# EAGLE design RGB_DMD_MINI (EAGLE 7.4.0)
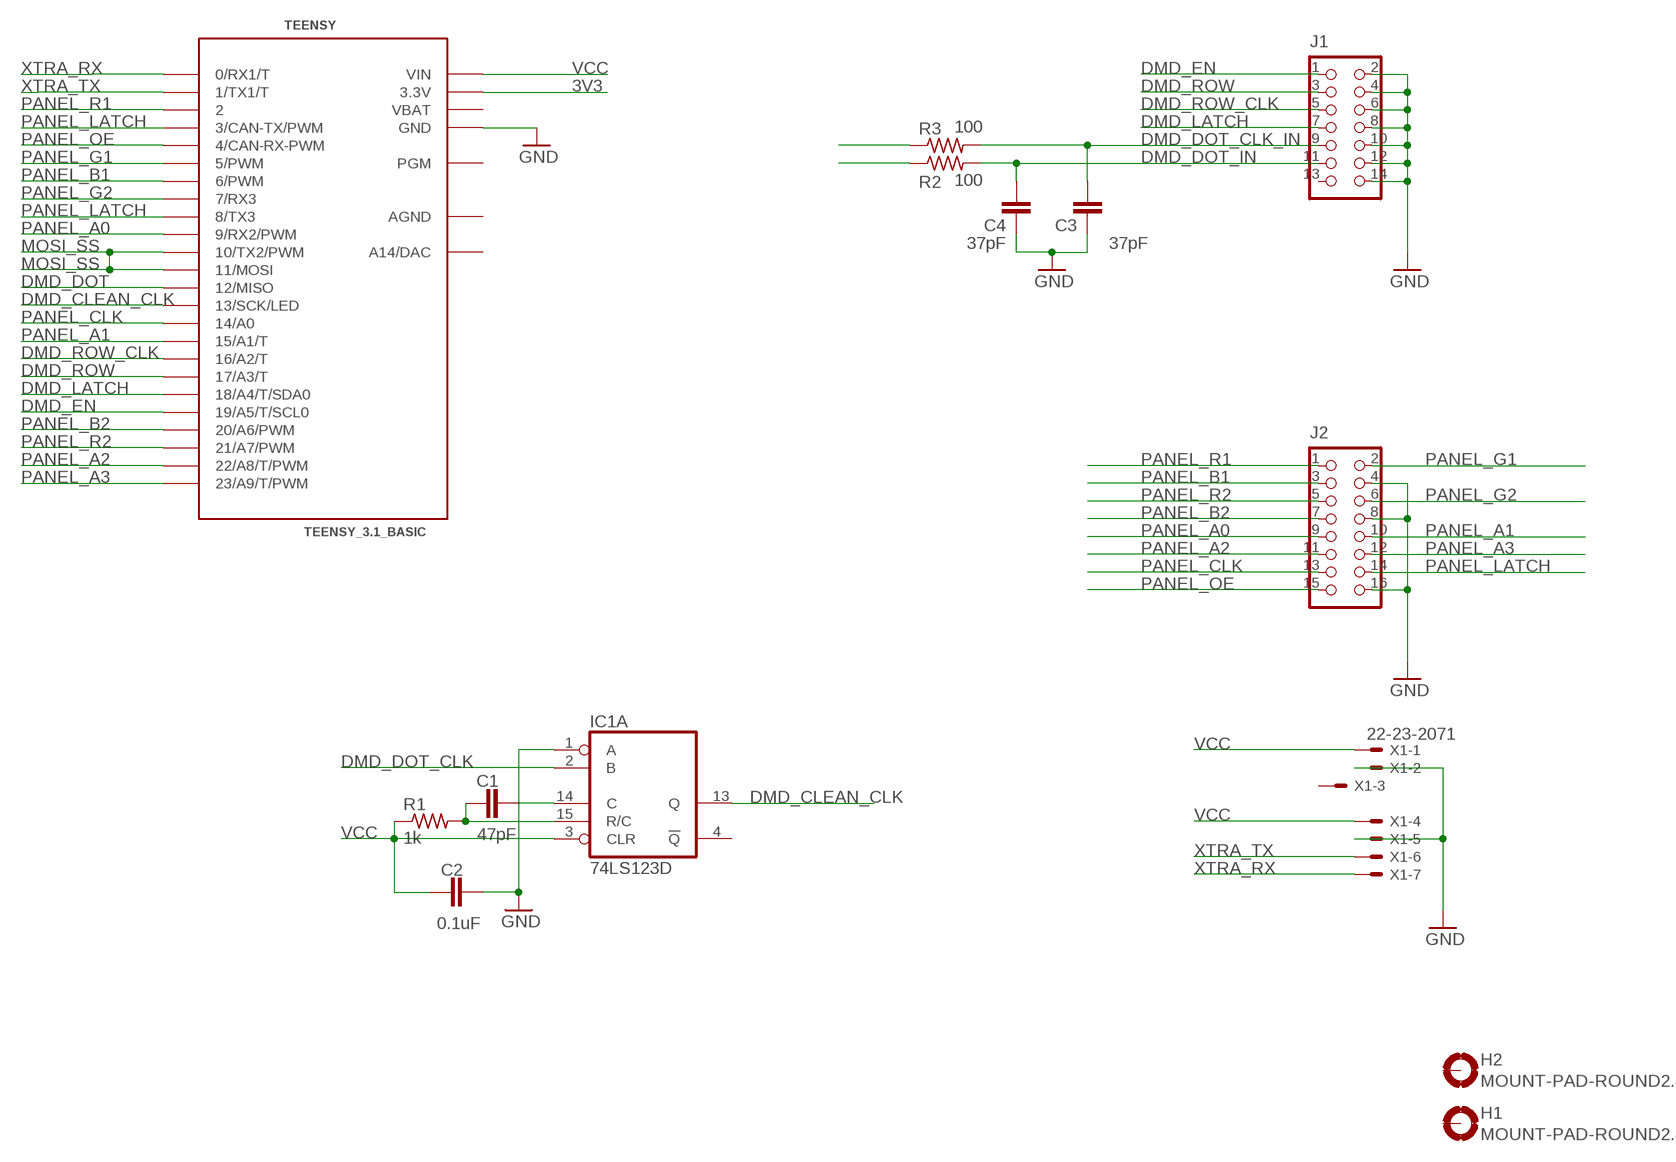
[diagram p0: schematic, sheet 1]

## Parts
C1  47pF  C-EUC0603  [C0603]
C2  0.1uF  C-EUC0603  [C0603]
C3  37pF  C-EUC0603  [C0603]
C4  37pF  C-EUC0603  [C0603]
H1  MOUNT-PAD-ROUND2.8  [2,8-PAD]
H2  MOUNT-PAD-ROUND2.8  [2,8-PAD]
IC1  74LS123D  [SO16]
J1  CON_HEADER_2X07-PTH-SHROUDED  [PINSHRD_PTH_2X07]
J2  CON_HEADER_2X08-PTH-SHROUDED  [PINSHRD_PTH_2X08]
R1  1k  R-US_R0603  [R0603]
R2  100  R-US_R0603  [R0603]
R3  100  R-US_R0603  [R0603]
TEENSY  TEENSY_3.1_BASIC  [TEENSY_3.1_BASIC]
X1  22-23-2071  [22-23-2071]

## Nets
3V3: TEENSY.3.3V TEENSY.3.3V1(3.3V)
DMD_CLEAN_CLK: IC1.13(A:Q) TEENSY.13(13/SCK/LED)
DMD_DOT: R2.1 TEENSY.12(12/MISO)
DMD_DOT_CLK: IC1.2(A:B) R3.1
DMD_DOT_CLK_IN: C3.2 J1.9 R3.2
DMD_DOT_IN: C4.2 J1.11 R2.2
DMD_EN: J1.1 TEENSY.19/A5(19/A5/T/SCL0)
DMD_LATCH: J1.7 TEENSY.18/A4(18/A4/T/SDA0)
DMD_ROW: J1.3 TEENSY.17/A3(17/A3/T)
DMD_ROW_CLK: J1.5 TEENSY.16/A2(16/A2/T)
GND: C2.2 C3.1 C4.1 IC1.1(A:A) J1.2 J1.4 J1.6 J1.8 J1.10 J1.12 J1.14 J2.4 J2.8 J2.16 TEENSY.GND TEENSY.GND1(GND) X1.2 X1.5
MOSI_SS: TEENSY.10(10/TX2/PWM) TEENSY.11(11/MOSI)
N$1: C1.1 IC1.15(A:R/C) R1.2
N$2: C1.2 IC1.14(A:C)
PANEL_A0: J2.9 TEENSY.9(9/RX2/PWM)
PANEL_A1: J2.10 TEENSY.15/A1(15/A1/T)
PANEL_A2: J2.11 TEENSY.22/A8(22/A8/T/PWM)
PANEL_A3: J2.12 TEENSY.23/A9(23/A9/T/PWM)
PANEL_B1: J2.3 TEENSY.6(6/PWM)
PANEL_B2: J2.7 TEENSY.20/A6(20/A6/PWM)
PANEL_CLK: J2.13 TEENSY.14/A0
PANEL_G1: J2.2 TEENSY.5(5/PWM)
PANEL_G2: J2.6 TEENSY.7(7/RX3)
PANEL_LATCH: J2.14 TEENSY.3(3/CAN-TX/PWM) TEENSY.8(8/TX3)
PANEL_OE: J2.15 TEENSY.4(4/CAN-RX-PWM)
PANEL_R1: J2.1 TEENSY.2
PANEL_R2: J2.5 TEENSY.21/A7(21/A7/PWM)
VCC: C2.1 IC1.3(A:CLR) R1.1 TEENSY.VIN X1.1 X1.4
XTRA_RX: TEENSY.0(0/RX1/T) X1.7
XTRA_TX: TEENSY.1(1/TX1/T) X1.6
Unconnected: H1.B2,8(MOUNT) H2.B2,8(MOUNT) IC1.4(A:!Q) IC1.5(B:Q) IC1.6(B:C) IC1.7(B:R/C) IC1.9(B:A) IC1.10(B:B) IC1.11(B:CLR) IC1.12(B:!Q) J1.13 TEENSY.A14(A14/DAC) TEENSY.PGM X1.3

## Power pins joined to a net without a drawn wire
AGND: TEENSY.AGND
GND: IC1.8(P:GND)
VBAT: TEENSY.VBAT
VCC: IC1.16(P:VCC)

## Library data of the parts
C1-C4 = resistor:C-EU: CAPACITOR, European symbol
H1 H2 = holes:MOUNT-PAD-ROUND: MOUNTING PAD, round
IC1 = 74xx-us:74*123: Retriggerable monostable MULTIVIBRATOR
J1 = dp_devices:CON_HEADER_2X07: 2x07 pin header
J2 = SmartMatrixShield_V1:CON_HEADER_2X08: 2x07 pin header
R1-R3 = resistor:R-US_: RESISTOR, American symbol
TEENSY = Teensy_3_Series_Board_v1.0:TEENSY_3.1_BASIC: Footprint for Teensy 3.1 board using all pin connections on the outer perimeter
X1 = con-molex:22-23-2071: .100" (2.54mm) Center Header - 7 Pin; MF: MOLEX; MPN: 22-23-2071; OC_FARNELL: 1654534; OC_NEWARK: 56H0445

## Board
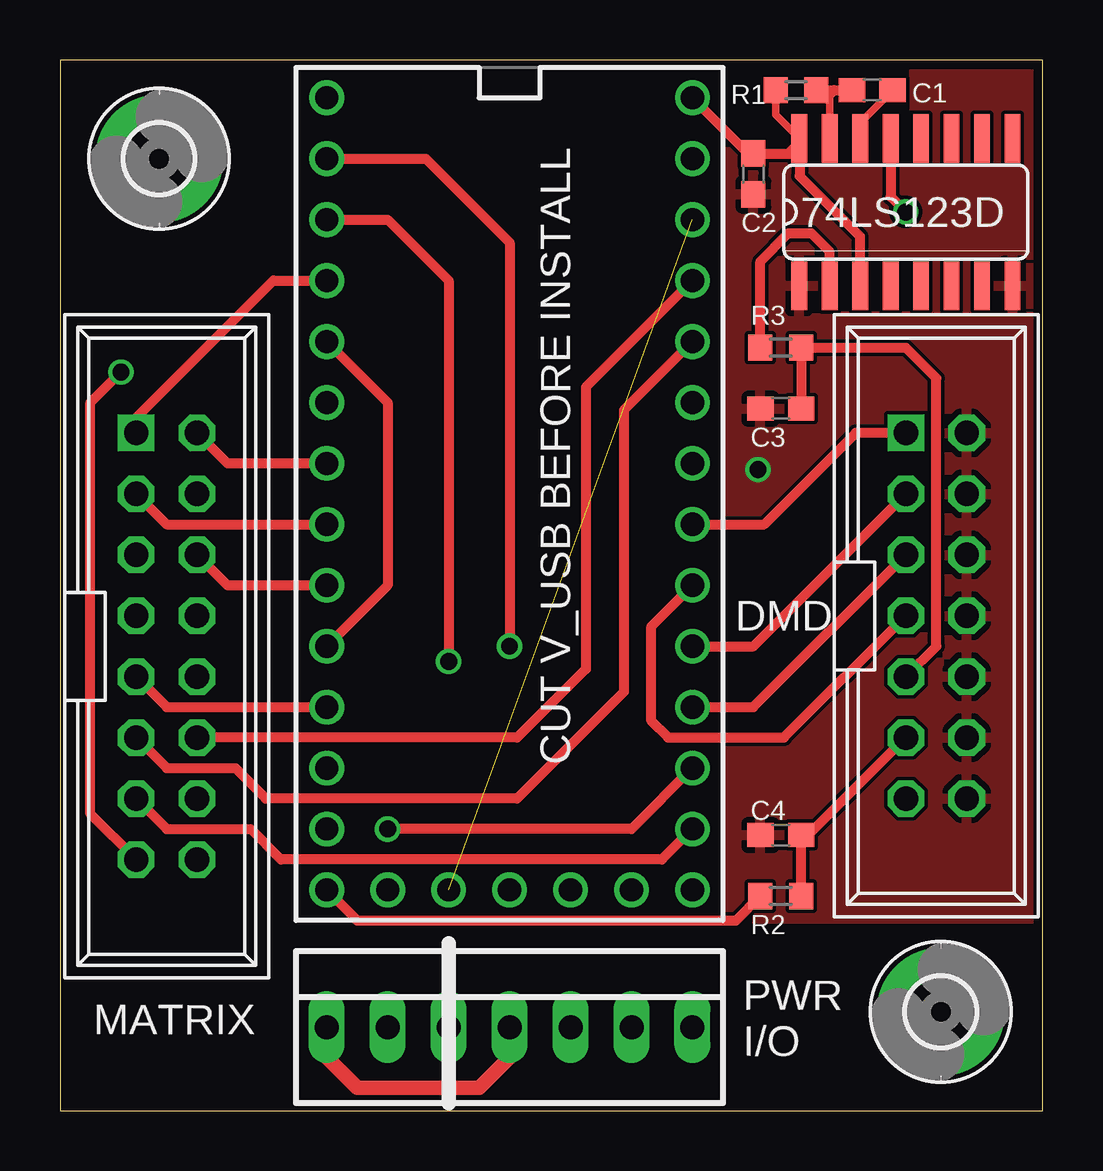
[diagram p1: board, top side]
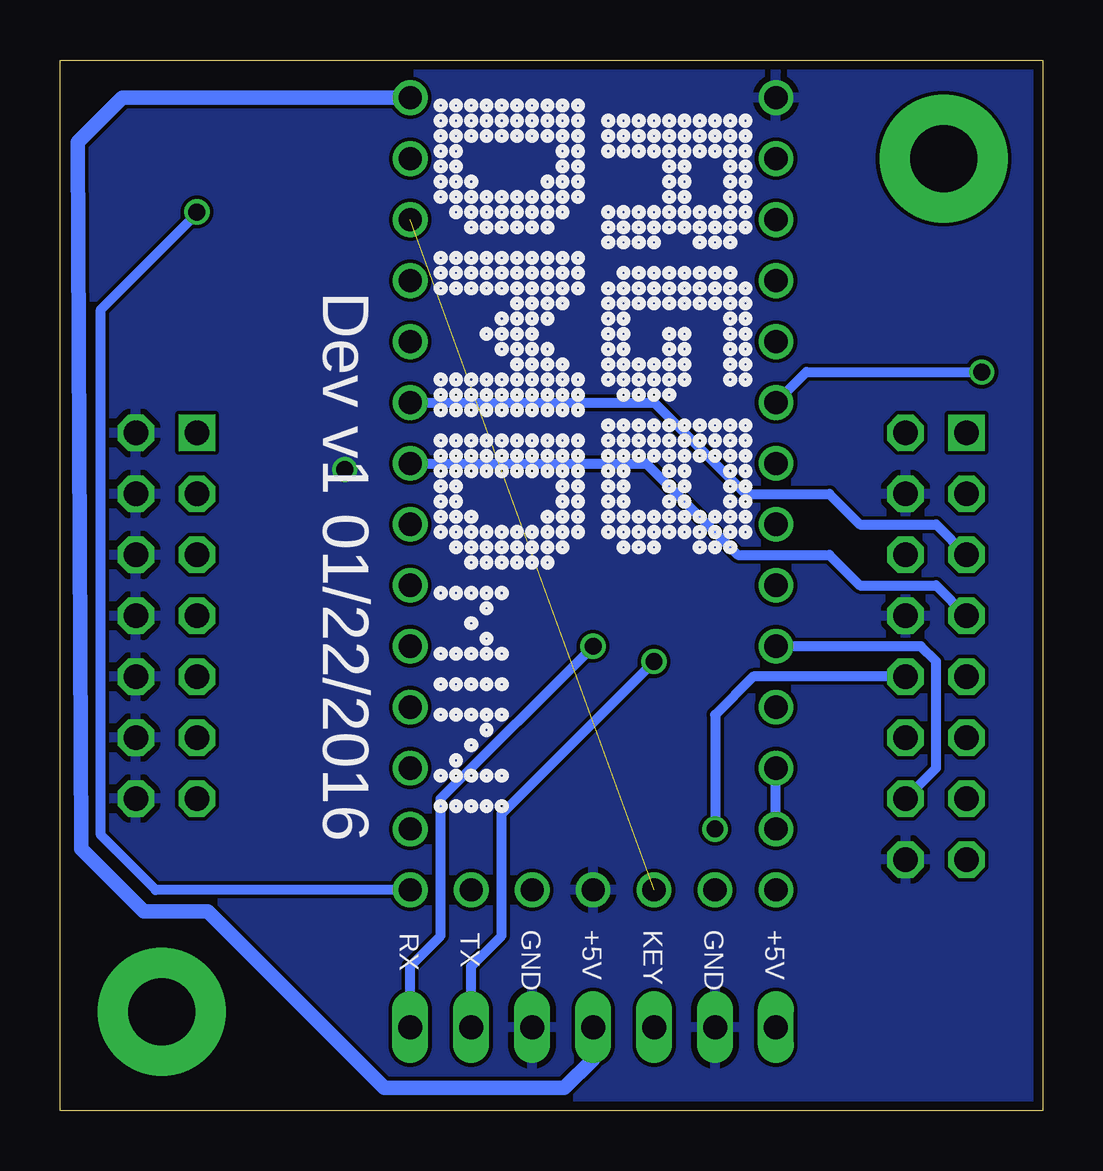
[diagram p2: board, bottom side, seen from below]

Size 40.95 x 43.8 mm. Coordinates in mm from the lower left corner, seen from the top.
Outline: 0,0 40.95,0 40.95,43.81 0,43.81 0,0
Copper layers (1*16): Top 0.0356mm / dielectric 1.5011mm / Bottom 0.0356mm
Design rules "LaenPCBOrder": minimum track width 6mil, minimum drill 13mil, track to track 6mil, track to pad 6mil, pad to pad 6mil, via to via 6mil, smd to smd 6mil, copper to edge 15mil, drill to drill 6mil, minimum pad ring 7mil, minimum via ring 7mil, stop-mask expansion 3mil, vias tented up to drill 0mil, thermal gap 10mil

### Footprints (pad centres in the part's own frame; a part is rotated, then mirrored left to right if it is on the bottom)
C0603 = smd 1.1 x 1: 1 -0.85,0; 2 0.85,0
2,8-PAD = drill 2.8 pad 5.334: B2,8 0,0
SO16 = smd 0.66 x 2.032: 1 -4.445,-3.073; 2 -3.175,-3.073; 3 -1.905,-3.073; 4 -0.635,-3.073; 5 0.635,-3.073; 6 1.905,-3.073; 7 3.175,-3.073; 8 4.445,-3.073; 9 4.445,3.073; 10 3.175,3.073; 11 1.905,3.073; 12 0.635,3.073; 13 -0.635,3.073; 14 -1.905,3.073; 15 -3.175,3.073; 16 -4.445,3.073
PINSHRD_PTH_2X07 = drill 1.016 square: 1 -7.62,-1.27 | drill 1.016 octagon: 2 -7.62,1.27; 3 -5.08,-1.27; 4 -5.08,1.27; 5 -2.54,-1.27; 6 -2.54,1.27; 7 0,-1.27; 8 0,1.27; 9 2.54,-1.27; 10 2.54,1.27; 11 5.08,-1.27; 12 5.08,1.27; 13 7.62,-1.27; 14 7.62,1.27
PINSHRD_PTH_2X08 = drill 1.016 square: 1 -8.89,-1.27 | drill 1.016 octagon: 2 -8.89,1.27; 3 -6.35,-1.27; 4 -6.35,1.27; 5 -3.81,-1.27; 6 -3.81,1.27; 7 -1.27,-1.27; 8 -1.27,1.27; 9 1.27,-1.27; 10 1.27,1.27; 11 3.81,-1.27; 12 3.81,1.27; 13 6.35,-1.27; 14 6.35,1.27; 15 8.89,-1.27; 16 8.89,1.27
R0603 = smd 1 x 1.1: 1 -0.85,0; 2 0.85,0
TEENSY_3.1_BASIC = drill 0.965: 0 -7.62,13.97; 1 -7.62,11.43; 2 -7.62,8.89; 3 -7.62,6.35; 3.3V 7.62,11.43; 3.3V1 -2.54,-16.51; 4 -7.62,3.81; 5 -7.62,1.27; 6 -7.62,-1.27; 7 -7.62,-3.81; 8 -7.62,-6.35; 9 -7.62,-8.89; 10 -7.62,-11.43; 11 -7.62,-13.97; 12 -7.62,-16.51; 13 7.62,-16.51; 14/A0 7.62,-13.97; 15/A1 7.62,-11.43; 16/A2 7.62,-8.89; 17/A3 7.62,-6.35; 18/A4 7.62,-3.81; 19/A5 7.62,-1.27; 20/A6 7.62,1.27; 21/A7 7.62,3.81; 22/A8 7.62,6.35; 23/A9 7.62,8.89; A14 5.08,-16.51; AGND 7.62,13.97; GND -7.62,16.51; GND1 0,-16.51; PGM 2.54,-16.51; VBAT -5.08,-16.51; VIN 7.62,16.51
22-23-2071 = drill 1 long: 1 -7.62,0; 2 -5.08,0; 3 -2.54,0; 4 0,0; 5 2.54,0; 6 5.08,0; 7 7.62,0

### Placement (x,y rotation side)
C1  33.85,42.54 0 top
C2  28.89,39.05 270 top
C3  30.04,29.27 0 top
C4  30.04,11.49 0 top
H1  4.13,39.69 0 top
H2  36.7,4.13 0 top
IC1  35.24,37.46 0 top
J1  36.51,20.64 270 top
J2  4.45,19.37 270 top
R1  30.67,42.54 0 top
R2  30.04,8.95 0 top
R3  30.04,31.81 0 top
TEENSY  18.73,25.72 0 top
X1  18.73,3.49 0 top

### Tracks (layer width: path | path; a pad name or v marks a point on that pad's centre or on a via)
3V3  (1 unrouted)
DMD_CLEAN_CLK  (via drill 0.7)
  Top 0.406: IC1.13 34.61,38.1 v35.24,37.46
  Bottom 0.406: TEENSY.13 36.96,9.21 39.24,11.49 39.24,33.4 35.24,37.4 v35.24,37.46
DMD_DOT
  Top 0.406: TEENSY.12 12.38,7.94 28.17,7.94 R2.1
DMD_DOT_CLK
  Top 0.406: R3.1 29.19,35.41 30.35,36.58 31.31,36.58 32.07,35.81 IC1.2
DMD_DOT_CLK_IN
  Top 0.406: C3.2 R3.2 35.24,31.81 36.51,30.54 36.51,19.37 J1.9
DMD_DOT_IN
  Top 0.406: R2.2 C4.2 31.18,11.49 J1.11
DMD_EN
  Top 0.406: TEENSY.19/A5 29.34,24.45 33.15,28.26 J1.1
DMD_LATCH
  Top 0.406: TEENSY.18/A4 24.64,20.19 24.64,16.26 25.34,15.56 30.16,15.56 J1.7
DMD_ROW
  Top 0.406: TEENSY.17/A3 28.89,19.37 J1.3
DMD_ROW_CLK
  Top 0.406: TEENSY.16/A2 28.89,16.83 J1.5
GND  (via drill 0.7)
  other vias: 29.08,26.73
  pour Bottom: 0.32,43.5 40.64,43.5 40.64,0.32 0.32,0.32
  pour Top: 27.81,43.24 40.51,43.24 40.51,8 27.81,8
MOSI_SS
  Bottom 0.406: TEENSY.11 TEENSY.10
N$1
  Top 0.305: IC1.15 32.07,42.35
  Top 0.406: R1.2 32.26,42.54 | 32.26,42.54 C1.1 | 32.07,42.35 32.26,42.54
N$2
  Top 0.305: 33.34,41.19 C1.2
  Top 0.406: IC1.14 33.34,41.19
PANEL_A0
  Top 0.406: J2.9 4.45,16.83 TEENSY.9
PANEL_A1  (via drill 0.7)
  Top 0.406: TEENSY.15/A1 23.81,11.75 v13.65,11.75
  Bottom 0.406: J2.10 12.06,18.1 13.65,16.51 v13.65,11.75
PANEL_A2
  Top 0.406: J2.11 4.45,14.29 7.3,14.29 8.57,13.02 19.05,13.02 23.5,17.46 23.5,29.21 TEENSY.22/A8
PANEL_A3
  Top 0.406: J2.12 19.05,15.56 21.91,18.42 21.91,30.16 TEENSY.23/A9
PANEL_B1
  Top 0.406: J2.3 4.45,24.45 TEENSY.6
PANEL_B2
  Bottom 0.406: TEENSY.20/A6 16.51,26.99 12.7,23.18 8.89,23.18 7.62,21.91 4.45,21.91 J2.7
PANEL_CLK
  Top 0.406: TEENSY.14/A0 25.08,10.48 9.21,10.48 7.94,11.75 4.45,11.75 J2.13
PANEL_G1
  Top 0.406: TEENSY.5 6.99,26.99 J2.2
PANEL_G2
  Top 0.406: TEENSY.7 6.99,21.91 J2.6
PANEL_LATCH
  Top 0.406: TEENSY.8 13.65,21.91 13.65,29.53 TEENSY.3
  Bottom 0.406: J2.14 4.45,14.29 4.45,18.73 5.08,19.37 TEENSY.8
PANEL_OE  (via drill 0.7)
  Top 0.406: J2.15 1.27,12.38 1.27,29.53 v2.54,30.8
  Bottom 0.406: TEENSY.4 9.84,30.8 v2.54,30.8
PANEL_R1
  Top 0.406: J2.1 3.17,28.89 8.89,34.61 TEENSY.2
PANEL_R2
  Bottom 0.406: TEENSY.21/A7 16.19,29.53 12.38,25.72 8.89,25.72 7.62,24.45 4.45,24.45 J2.5
VCC
  Top 0.305: R1.1 29.82,41.52 IC1.16
  Top 0.406: TEENSY.VIN 28.68,39.9 C2.1 30.35,39.9 | 30.35,39.9 30.82,39.9 30.82,38.96 33.34,36.45 IC1.3 | IC1.16 30.8,40.35 30.35,39.9
  Top 0.61: X1.4 18.73,2.22 17.46,0.95 12.38,0.95 11.11,2.22 X1.1
  Bottom 0.61: X1.4 18.73,2.16 19.94,0.95 27.43,0.95 34.8,8.32 37.46,8.32 40.07,10.92 40.07,11.05 40.2,40.39 38.35,42.23 TEENSY.VIN
XTRA_RX  (via drill 0.7)
  Top 0.406: TEENSY.0 15.24,39.69 18.73,36.2 v18.73,19.37
  Bottom 0.406: v18.73,19.37 25.08,13.02 25.08,7.3 26.35,6.03 X1.7
XTRA_TX  (via drill 0.7)
  Top 0.406: TEENSY.1 13.65,37.15 16.19,34.61 v16.19,18.73
  Bottom 0.406: v16.19,18.73 22.54,12.38 22.54,7.3 23.81,6.03 X1.6

### Text on the board
tPlace: DMD | MATRIX
tNames: CUT V_USB BEFORE INSTALL | PWR / I/O
bNames: Dev v1 01/22/2016 | +5V | GND | KEY | +5V | GND | TX | RX